# EasyEDA Pro project NV_Sensor.eprj

# Schematic ADS1115
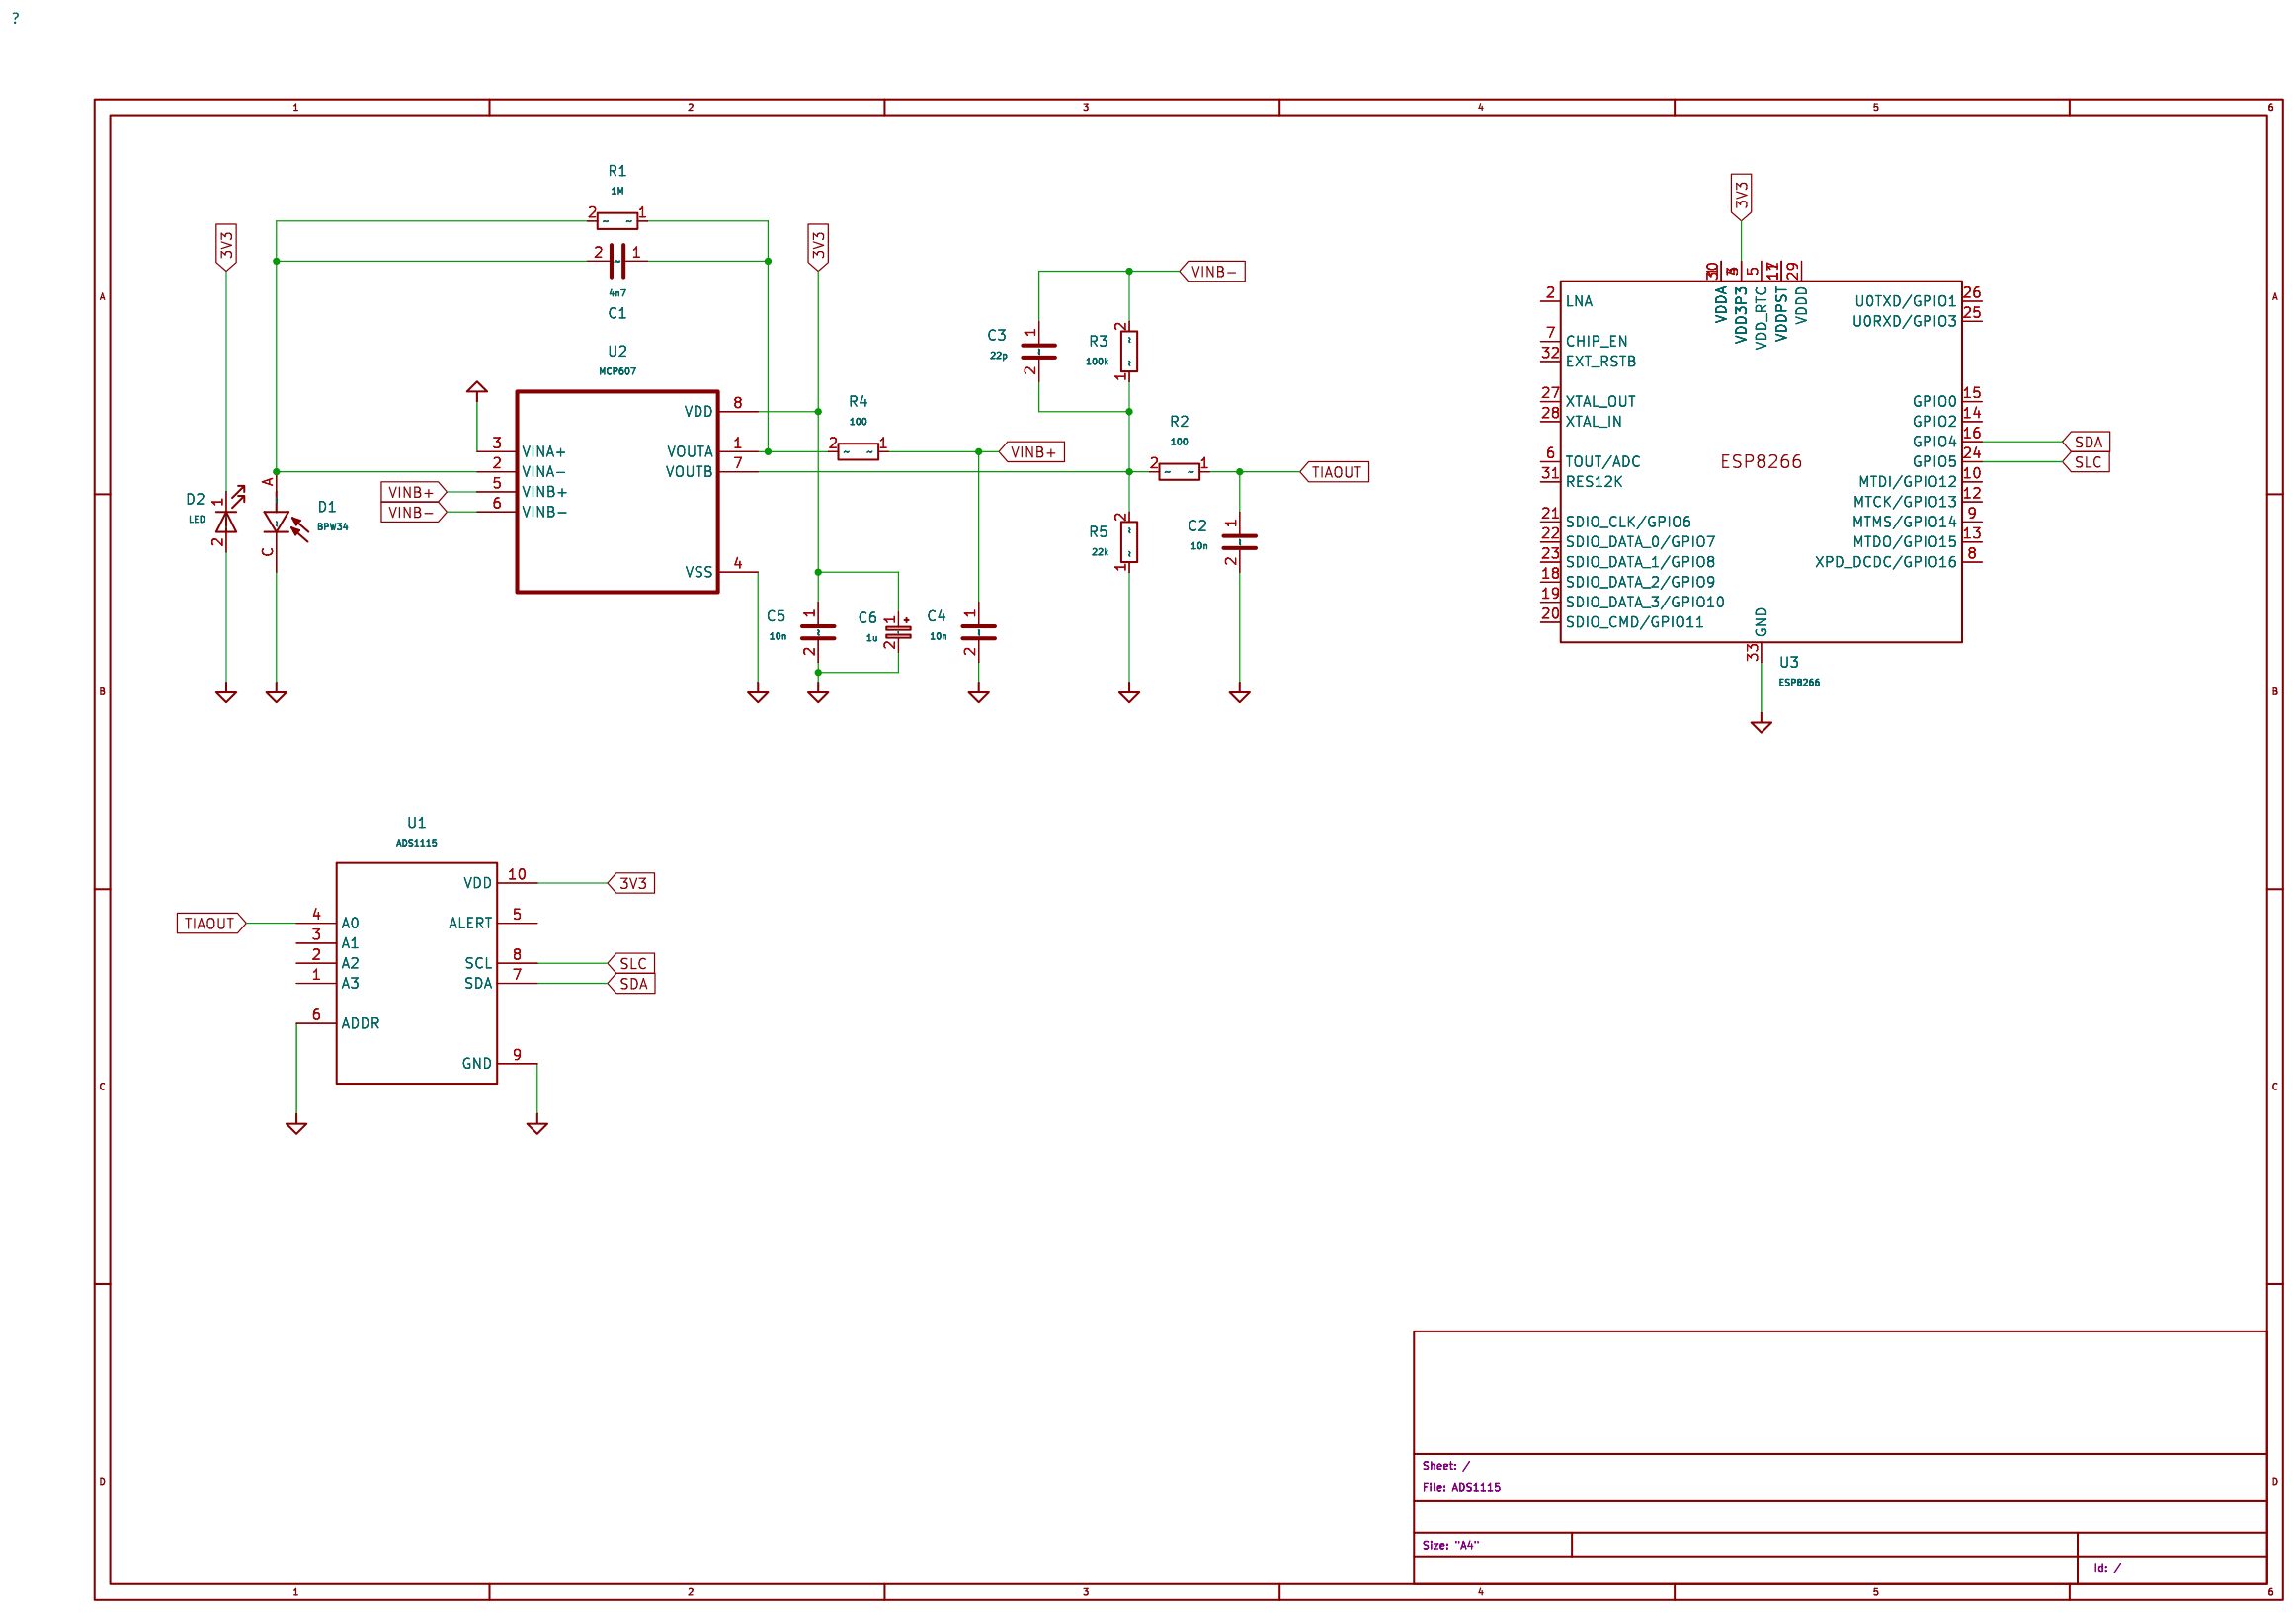
[diagram p0: schematic sheet]

## Parts
C1  4n7
C2  10n
C3  22p
C4  10n
C5  10n
C6  1u
D1  BPW34
D2  LED
R1  1M
R2  100
R3  100k
R4  100
R5  22k
U1  ADS1115
U2  MCP607
U3  ESP8266

## Library data of the parts
C1-C5 = Device_C: Unpolarized capacitor
C6 = Device_C_Polarized_Small: Polarized capacitor, small symbol
D1 = BPW34_BPW34: MF: Vishay Semiconductor; MAXIMUM_PACKAGE_HEIGHT: 2.20mm; Package1: None; Price: None; Check_prices: https://www.snapeda.com/parts/BPW34/Vishay/view-part/?ref=eda; STANDARD: IPC-7351B; PARTREV: 2.1; SnapEDA_Link: https://www.snapeda.com/parts/BPW34/Vishay/view-part/?ref=snap; Description_1: Photodiode 900nm - 130° 2-DIP (0.200, 5.10mm); Availability: In Stock; MANUFACTURER: Vishay
D2 = Device_LED: Light emitting diode; Sim_Pins: 1=K 2=A; Sim.Pins: 1=K 2=A
R1-R5 = Device_R: Resistor
U1 = ZC261500_ZC261500: MF: YKS; MAXIMUM_PACKAGE_HEIGHT: NA; Package1: None; Price: None; Check_prices: https://www.snapeda.com/parts/ZC261500/YKS/view-part/?ref=eda; STANDARD: Manufacturer Recommendations; PARTREV: NA; SnapEDA_Link: https://www.snapeda.com/parts/ZC261500/YKS/view-part/?ref=snap; MP: ZC261500; Description_1: ADS1115 Module ADC 4 channel with Pro Gain Amplifier for Arduino RPi; Availability: Not in stock; MANUFACTURER: YKS
U2 = MCP607-I_P_MCP607-I_P: MF: Microchip; Description_1: Microchip MCP607-I/P,Dual Op Amp,0.155MHz CMOS,Rail to Rail,3V,5V,8-Pin PDIP | Microchip Technology Inc. MCP607-I/P; Package1: DIP-8 Microchip; Price: None; SnapEDA_Link: https://www.snapeda.com/parts/MCP607-I/P/Microchip+Technology/view-part/?ref=snap; MP: MCP607-I/P; Availability: In Stock; Check_prices: https://www.snapeda.com/parts/MCP607-I/P/Microchip+Technology/view-part/?ref=eda
U3 = Espressif_ESP8266: Espressif’s ESP8266EX delivers highly integrated Wi-Fi SoC solution to meet users’ continuous demands for efficient power usage, compact design and reliable performance in the Internet of Things industry.; User doc link: https://www.espressif.com/sites/default/files/documentation/0a-esp8266ex_datasheet_en.pdf

## Nets
3V3: C5.1 C6.1 D2.1(K) U1.10(VDD) U2.8(VDD) U3.3(VDD3P3) U3.4(VDD3P3)
VINB+: C4.1 R4.1 U2.5(VINB+)
VINB-: C3.1 R3.2 U2.6(VINB-)
POWER_GND: C2.2 C4.2 C5.2 C6.2 D1.C D2.2(A) R5.1 U1.6(ADDR) U1.9(GND) U2.3(VINA+) U2.4(VSS) U3.33(GND)
SDA: U1.7(SDA) U3.16(GPIO4)
SLC: U1.8(SCL) U3.24(GPIO5)
TIAOUT: C2.1 R2.1 U1.4(A0)
Net-(C1-1): C1.1 R1.1 R4.2 U2.1(VOUTA)
Net-(C1-2): C1.2 D1.A R1.2 U2.2(VINA-)
Net-(C3-2): C3.2 R2.2 R3.1 R5.2 U2.7(VOUTB)
Net-(U3-1): U3.1(VDDA) U3.30(VDDA)
Net-(U3-11): U3.11(VDDPST) U3.17(VDDPST)

Not connected (* = marked no-connect by the designer): U1 1(A3) 2(A2) 3(A1) 5(ALERT); U3 2(LNA) 5(VDD_RTC) 6(TOUT/ADC) 7(CHIP_EN) 8(XPD_DCDC/GPIO16) 9(MTMS/GPIO14) 10(MTDI/GPIO12) 12(MTCK/GPIO13) 13(MTDO/GPIO15) 14(GPIO2) 15(GPIO0) 18(SDIO_DATA_2/GPIO9) 19(SDIO_DATA_3/GPIO10) 20(SDIO_CMD/GPIO11) 21(SDIO_CLK/GPIO6) 22(SDIO_DATA_0/GPIO7) 23(SDIO_DATA_1/GPIO8) 25(U0RXD/GPIO3) 26(U0TXD/GPIO1) 27(XTAL_OUT) 28(XTAL_IN) 29(VDDD) 31(RES12K) 32(EXT_RSTB)
